# EasyEDA schematic Fonte_Variavel_Esquematico.json
TITLE: Fonte Variável; REV: 1.0; Date: 2022-08-21; Sheet: 1/1; Drawn By: vyni; Company: SENAI
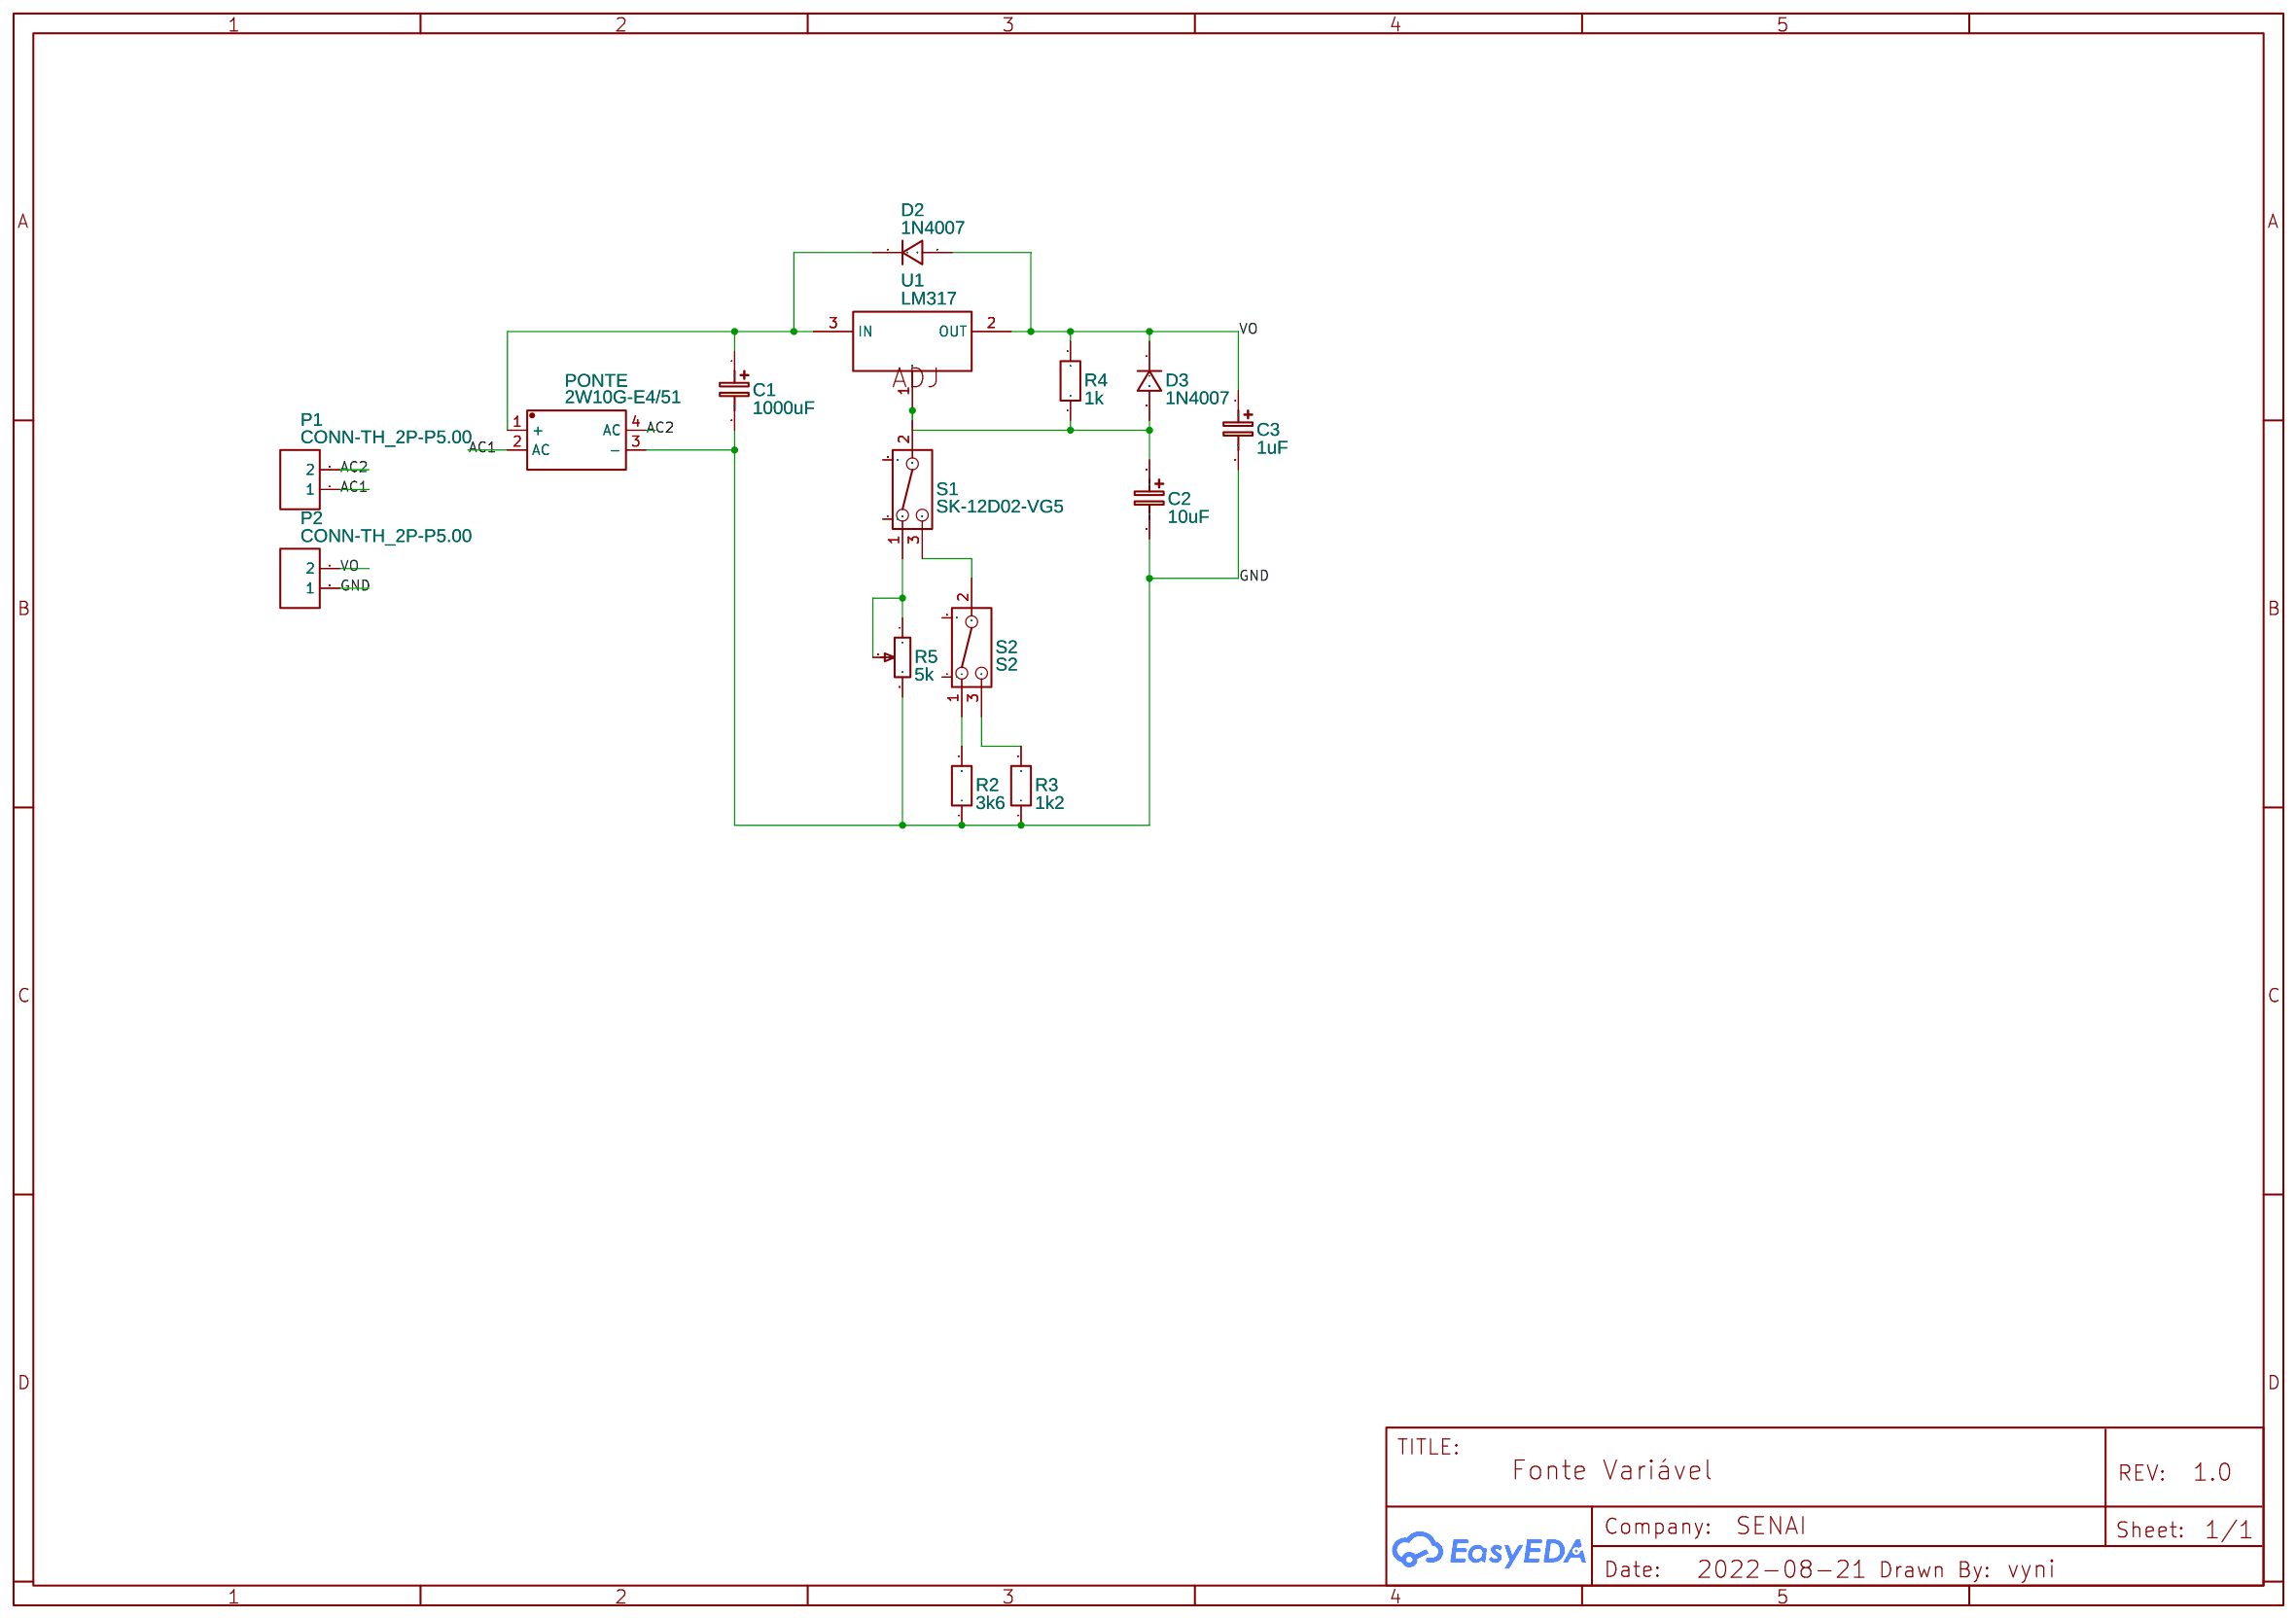
[diagram p0: schematic sheet]

## Parts
C1  1000uF  [CAP-D6.3×F2.5]
C2  10uF  [CAP-D6.3×F2.5]
C3  1uF  [CAP-D6.3×F2.5]
D2  1N4007  [DO-41_BD2.4-L4.7-P8.70-D0.9-RD]
D3  1N4007  [DO-41_BD2.4-L4.7-P8.70-D0.9-RD]
P1  CONN-TH_2P-P5.00  [CONN-TH_2P-P5.00]
P2  CONN-TH_2P-P5.00  [CONN-TH_2P-P5.00]
PONTE  2W10G-E4/51  [DIO-BG-TH_WOG-4]
R2  3k6  [R_AXIAL-0.4]
R3  1k2  [R_AXIAL-0.4]
R4  1k  [R_AXIAL-0.4]
R5  5k  [POTENCIOMETRO]
S1  SK-12D02-VG5  [SW-TH_SK-12D02VG3]
S2  S2  [SW-TH_SK-12D02VG3]
U1  LM317  [TO-92-3_L4.9-W3.7-P1.27-L]

## Library data of the parts
C1-C3 = CE_TH_D6.3×F2.5_EU: Contributor: LCEDA_Lib
D2 D3 = 1N4007: Supplier: LCSC; Manufacturer: SEMTECH; Supplier Part: C106903; Contributor: LCEDA_Lib
P1 P2 = CONN-TH_2P-P5.00: Supplier: LCSC; Contributor: LCEDA_Lib
PONTE = 2W10G-E4/51: Supplier: LCSC; Supplier Part: C266671; Manufacturer: Vishay Intertech; Contributor: LCSC; JLCPCB Part Class: Extended Part
R2-R4 = R_AXIAL-0.4_EU: Contributor: LCEDA_Lib
R5 = PONTENCIOMETRO COPY COPY: Supplier: LCSC; Manufacturer: Bochen; Manufacturer Part: 3386P-1-101LF; Resistance(Ohms): 100; Supplier Part: C125022; Contributor: Alessandro da Silva Moreira
S1 S2 = SK-12D02-VG5: Supplier: LCSC; Supplier Part: C136722; Manufacturer: Rectangular Connectors - Contacts; Contributor: LCSC
U1 = LM317LZ/LFT2: Supplier: LCSC; Supplier Part: C2877243; Manufacturer: TI(德州仪器); link: https://atta.szlcsc.comnull; Contributor: lcsc

## Nets
GND: C1.2 C2.2 C3.2 P2.1 PONTE.3(-) R2.1 R3.1 R5.3
AC1: P1.1 PONTE.2(AC)
AC2: P1.2 PONTE.4(AC)
VO: C3.1 D2.2 D3.1 P2.2 R4.2 U1.2(OUT)
Net-(C1-1): C1.1 D2.1 PONTE.1(+) U1.3(IN)
Net-(C2-1): C2.1 D3.2 R4.1 S1.2 U1.1(ADJ)
Net-(R2-2): R2.2 S2.1
Net-(R3-2): R3.2 S2.3
Net-(R5-1): R5.1 R5.2 S1.1
Net-(S1-3): S1.3 S2.2

Not connected (* = marked no-connect by the designer): S1 4 5; S2 4 5
